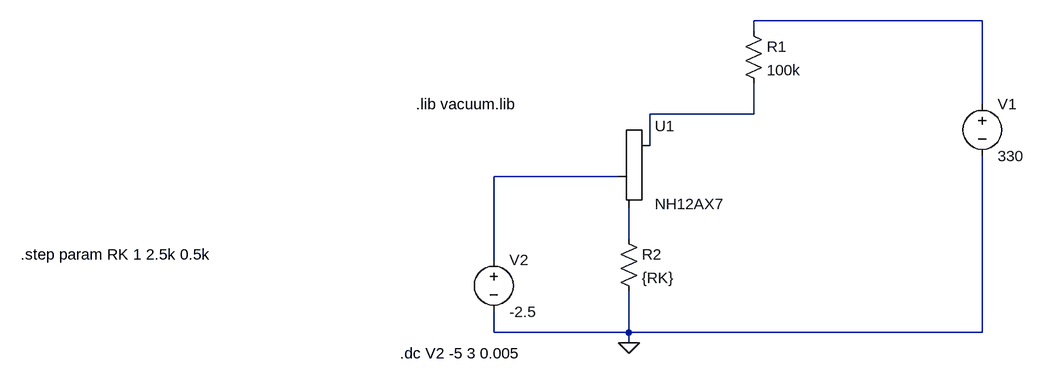
[diagram p0: schematic dvdt.asc]
dvdt.asc, the LTspice schematic file:
Version 4
SHEET 1 880 680
WIRE 752 -96 400 -96
WIRE 400 -80 400 -96
WIRE 752 32 752 -96
WIRE 400 48 400 0
WIRE 400 48 240 48
WIRE 240 96 240 48
WIRE 192 144 0 144
WIRE 208 240 208 192
WIRE 0 272 0 144
WIRE 0 384 0 352
WIRE 208 384 208 320
WIRE 208 384 0 384
WIRE 752 384 752 112
WIRE 752 384 208 384
WIRE 208 400 208 384
FLAG 208 400 0
SYMBOL Misc\\triode 240 144 R0
SYMATTR InstName U1
SYMATTR Value NH12AX7
SYMATTR SpiceLine X1 A G K NH12AX7
SYMBOL voltage 752 16 R0
WINDOW 123 0 0 Left 0
WINDOW 39 0 0 Left 0
SYMATTR InstName V1
SYMATTR Value 330
SYMBOL voltage 0 256 R0
WINDOW 123 0 0 Left 0
WINDOW 39 0 0 Left 0
SYMATTR InstName V2
SYMATTR Value -2.5
SYMBOL res 384 -96 R0
SYMATTR InstName R1
SYMATTR Value 100k
SYMBOL res 192 224 R0
SYMATTR InstName R2
SYMATTR Value {RK}
TEXT -120 32 Left 2 !.lib vacuum.lib
TEXT -144 416 Left 2 !.dc V2 -5 3 0.005
TEXT -728 264 Left 2 !.step param RK 1 2.5k 0.5k

The netlist it stands for:
* dvdt.asc
XU1 N002 N003 N004 NH12AX7 X1 A G K NH12AX7
V1 N001 0 330
V2 N003 0 -2.5
R1 N001 N002 100k
R2 N004 0 {RK}
.lib vacuum.lib
.dc V2 -5 3 0.005
.step param RK 1 2.5k 0.5k
.backanno
.end